# Altium schematic sheet MCU.SchDoc
size A4
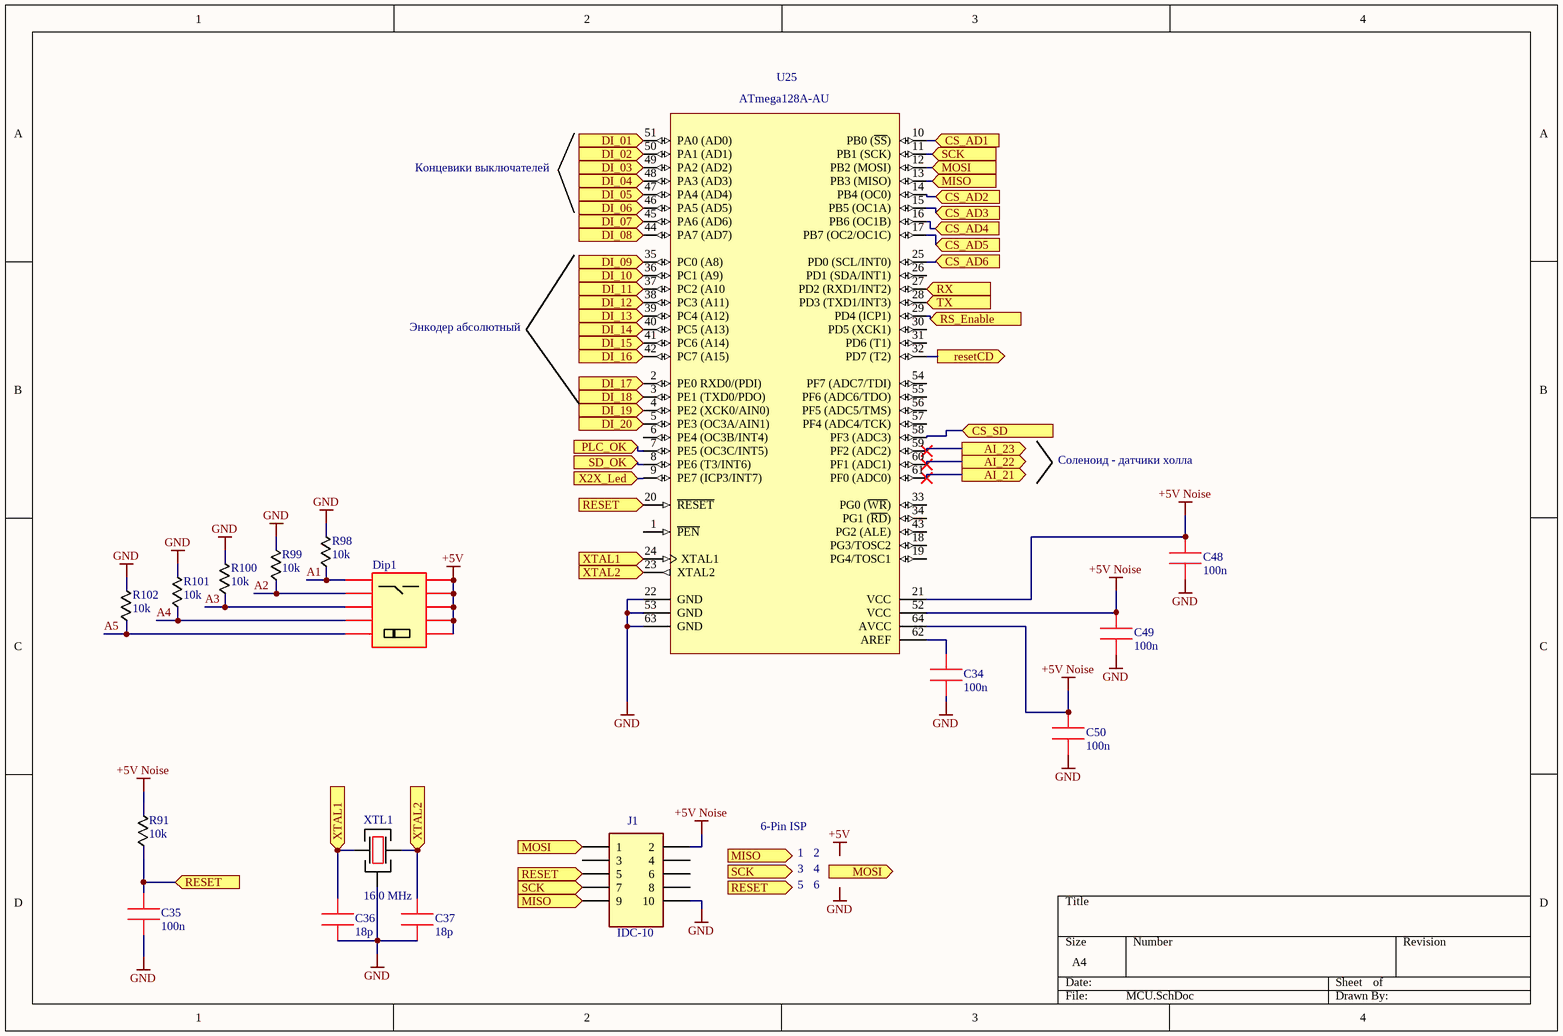
[diagram p0: MCU.SchDoc]

## Parts
C34  100n  [0603]
C35  100n  [0603]
C36  18p  [0603]
C37  18p  [0603]
C48  100n  [0603]
C49  100n  [0603]
C50  100n  [0603]
Dip1  DS1040-05RT  [DipSwitch 5]  (value not drawn)
J1  IDC-10  [IDC-10MS]
R91  10k  [0603]
R98  10k  [0603]
R99  10k  [0603]
R100  10k  [0603]
R101  10k  [0603]
R102  10k  [0603]
U25  ATmega128A-AU  [64A_N]
XTL1  16.0 MHz  [ABM10]

## Ports
AI_21, AI_22, AI_23, CS_AD1, CS_AD2, CS_AD3, CS_AD4, CS_AD5, CS_AD6, CS_SD, DI_01, DI_02, DI_03, DI_04, DI_05, DI_06, DI_07, DI_08, DI_09, DI_10, DI_11, DI_12, DI_13, DI_14, DI_15, DI_16, DI_17, DI_18, DI_19, DI_20, MISO, MOSI, PLC_OK, RESET, resetCD, RS_Enable, RX, SCK, SD_OK, TX, X2X_Led, XTAL1, XTAL2

## Nets
+5V: Dip1.1 Dip1.2 Dip1.3 Dip1.4 Dip1.5
+5V Noise: C48.2 C49.2 C50.2 J1.2 R91.2 U25.21(VCC) U25.52(VCC) U25.64(AVCC)
GND: C34.1 C35.1 C36.1 C37.1 C48.1 C49.1 C50.1 J1.10 R98.2 R99.2 R100.2 R101.2 R102.2 U25.22(GND) U25.53(GND) U25.63(GND) XTL1.2
A1: Dip1.12 R98.1
A2: Dip1.13 R99.1
A3: Dip1.14 R100.1
A4: Dip1.15 R101.1
A5: Dip1.16 R102.1
AI_21: U25.61(PF0_(ADC0)) ; port AI_21
AI_22: U25.60(PF1_(ADC1)) ; port AI_22
AI_23: U25.59(PF2_(ADC2)) ; port AI_23
CS_AD1: U25.10(PB0_(~{SS})) ; port CS_AD1
CS_AD2: U25.14(PB4_(OC0)) ; port CS_AD2
CS_AD3: U25.15(PB5_(OC1A)) ; port CS_AD3
CS_AD4: U25.16(PB6_(OC1B)) ; port CS_AD4
CS_AD5: U25.17(PB7_(OC2/OC1C)) ; port CS_AD5
CS_AD6: U25.25(PD0_(SCL/INT0)) ; port CS_AD6
CS_SD: U25.58(PF3_(ADC3)) ; port CS_SD
DI_01: U25.51(PA0_(AD0)) ; port DI_01
DI_02: U25.50(PA1_(AD1)) ; port DI_02
DI_03: U25.49(PA2_(AD2)) ; port DI_03
DI_04: U25.48(PA3_(AD3)) ; port DI_04
DI_05: U25.47(PA4_(AD4)) ; port DI_05
DI_06: U25.46(PA5_(AD5)) ; port DI_06
DI_07: U25.45(PA6_(AD6)) ; port DI_07
DI_08: U25.44(PA7_(AD7)) ; port DI_08
DI_09: U25.35(PC0_(A8)) ; port DI_09
DI_10: U25.36(PC1_(A9)) ; port DI_10
DI_11: U25.37(PC2_(A10) ; port DI_11
DI_12: U25.38(PC3_(A11)) ; port DI_12
DI_13: U25.39(PC4_(A12)) ; port DI_13
DI_14: U25.40(PC5_(A13)) ; port DI_14
DI_15: U25.41(PC6_(A14)) ; port DI_15
DI_16: U25.42(PC7_(A15)) ; port DI_16
DI_17: U25.2(PE0_RXD0/(PDI)) ; port DI_17
DI_18: U25.3(PE1_(TXD0/PDO)) ; port DI_18
DI_19: U25.4(PE2_(XCK0/AIN0)) ; port DI_19
DI_20: U25.5(PE3_(OC3A/AIN1)) ; port DI_20
MISO: J1.9 U25.13(PB3_(MISO)) ; port MISO
MOSI: J1.1 U25.12(PB2_(MOSI)) ; port MOSI
PLC_OK: U25.7(PE5_(OC3C/INT5)) ; port PLC_OK
RESET: C35.2 J1.5 R91.1 U25.20(~{RESET}) ; port RESET
resetCD: U25.32(PD7_(T2)) ; port resetCD
RS_Enable: U25.29(PD4_(ICP1)) ; port RS_Enable
RX: U25.27(PD2_(RXD1/INT2)) ; port RX
SCK: J1.7 U25.11(PB1_(SCK)) ; port SCK
SD_OK: U25.8(PE6_(T3/INT6)) ; port SD_OK
TX: U25.28(PD3_(TXD1/INT3)) ; port TX
X2X_Led: U25.9(PE7_(ICP3/INT7)) ; port X2X_Led
XTAL1: C36.2 U25.24(XTAL1) XTL1.1 ; port XTAL1
XTAL2: C37.2 U25.23(XTAL2) XTL1.3 ; port XTAL2
NetC34_2: C34.2 U25.62(AREF)

Not connected (* = marked no-connect by the designer): J1 3 4 6 8; U25 1(~{PEN}) 6(PE4_(OC3B/INT4)) 18(PG3/TOSC2) 19(PG4/TOSC1) 26(PD1_(SDA/INT1)) 30(PD5_(XCK1)) 31(PD6_(T1)) 33(PG0_(~{WR})) 34(PG1_(~{RD})) 43(PG2_(ALE)) 54(PF7_(ADC7/TDI)) 55(PF6_(ADC6/TDO)) 56(PF5_(ADC5/TMS)) 57(PF4_(ADC4/TCK))

## Notes on the sheet
- Концевики выключателей
- Энкодер абсолютный
- Соленоид - датчики холла
- 6-Pin ISP
- 1
- 2
- 3
- 5
- 4
- 6
- Labels drawn without touching a wire or pin: +5V, GND

## Library data of the parts
C34 C35 C48-C50 = 0603 CAP: CC0603KRX7R9BB104
C36 C37 = 0603 CAP: CC0603JRNPO9BN180
Dip1 = DipSwitch5: DPL-05-V
J1 = IDC-10MS: DS1013-10SSIB1-B-0
R91 R98-R102 = 0603 RES: RT0603FRE0710KL
U25 = ATmega128A-AU: 8-bit AVR Microcontroller, 2.7-5.5V, 16MHz, 128KB Flash, 4KB EEPROM, 4KB SRAM, 64-pin TQFP, Industrial Grade (-40°C to 85°C); DatasheetVersion: revH, Feb-2011; PackageVersion: revC, Oct-2010; PackageReference: 64A; PackageDescription: 64-Pin Plastic Thin Profile Quad Flat Pack, 14 x 14 x 1.0 mm Body, 0.8 mm Pitch (TQFP); Code_JEDEC: MS-026-AEB; ComponentLink1Description: Manufacturer URL; ComponentLink1URL: http://www.atmel.com/; ComponentLink2Description: ATmega128A Datasheet; ComponentLink2URL: http://www.atmel.com/dyn/resources/prod_documents/doc8151.pdf; ComponentLink3Description: ATmega128A Summary; ComponentLink3URL: http://www.atmel.com/dyn/resources/prod_documents/8151S.pdf
XTL1 = KX-7: 12.88605